# EAGLE design PowerSensingBoard2 (EAGLE 7.5.0)
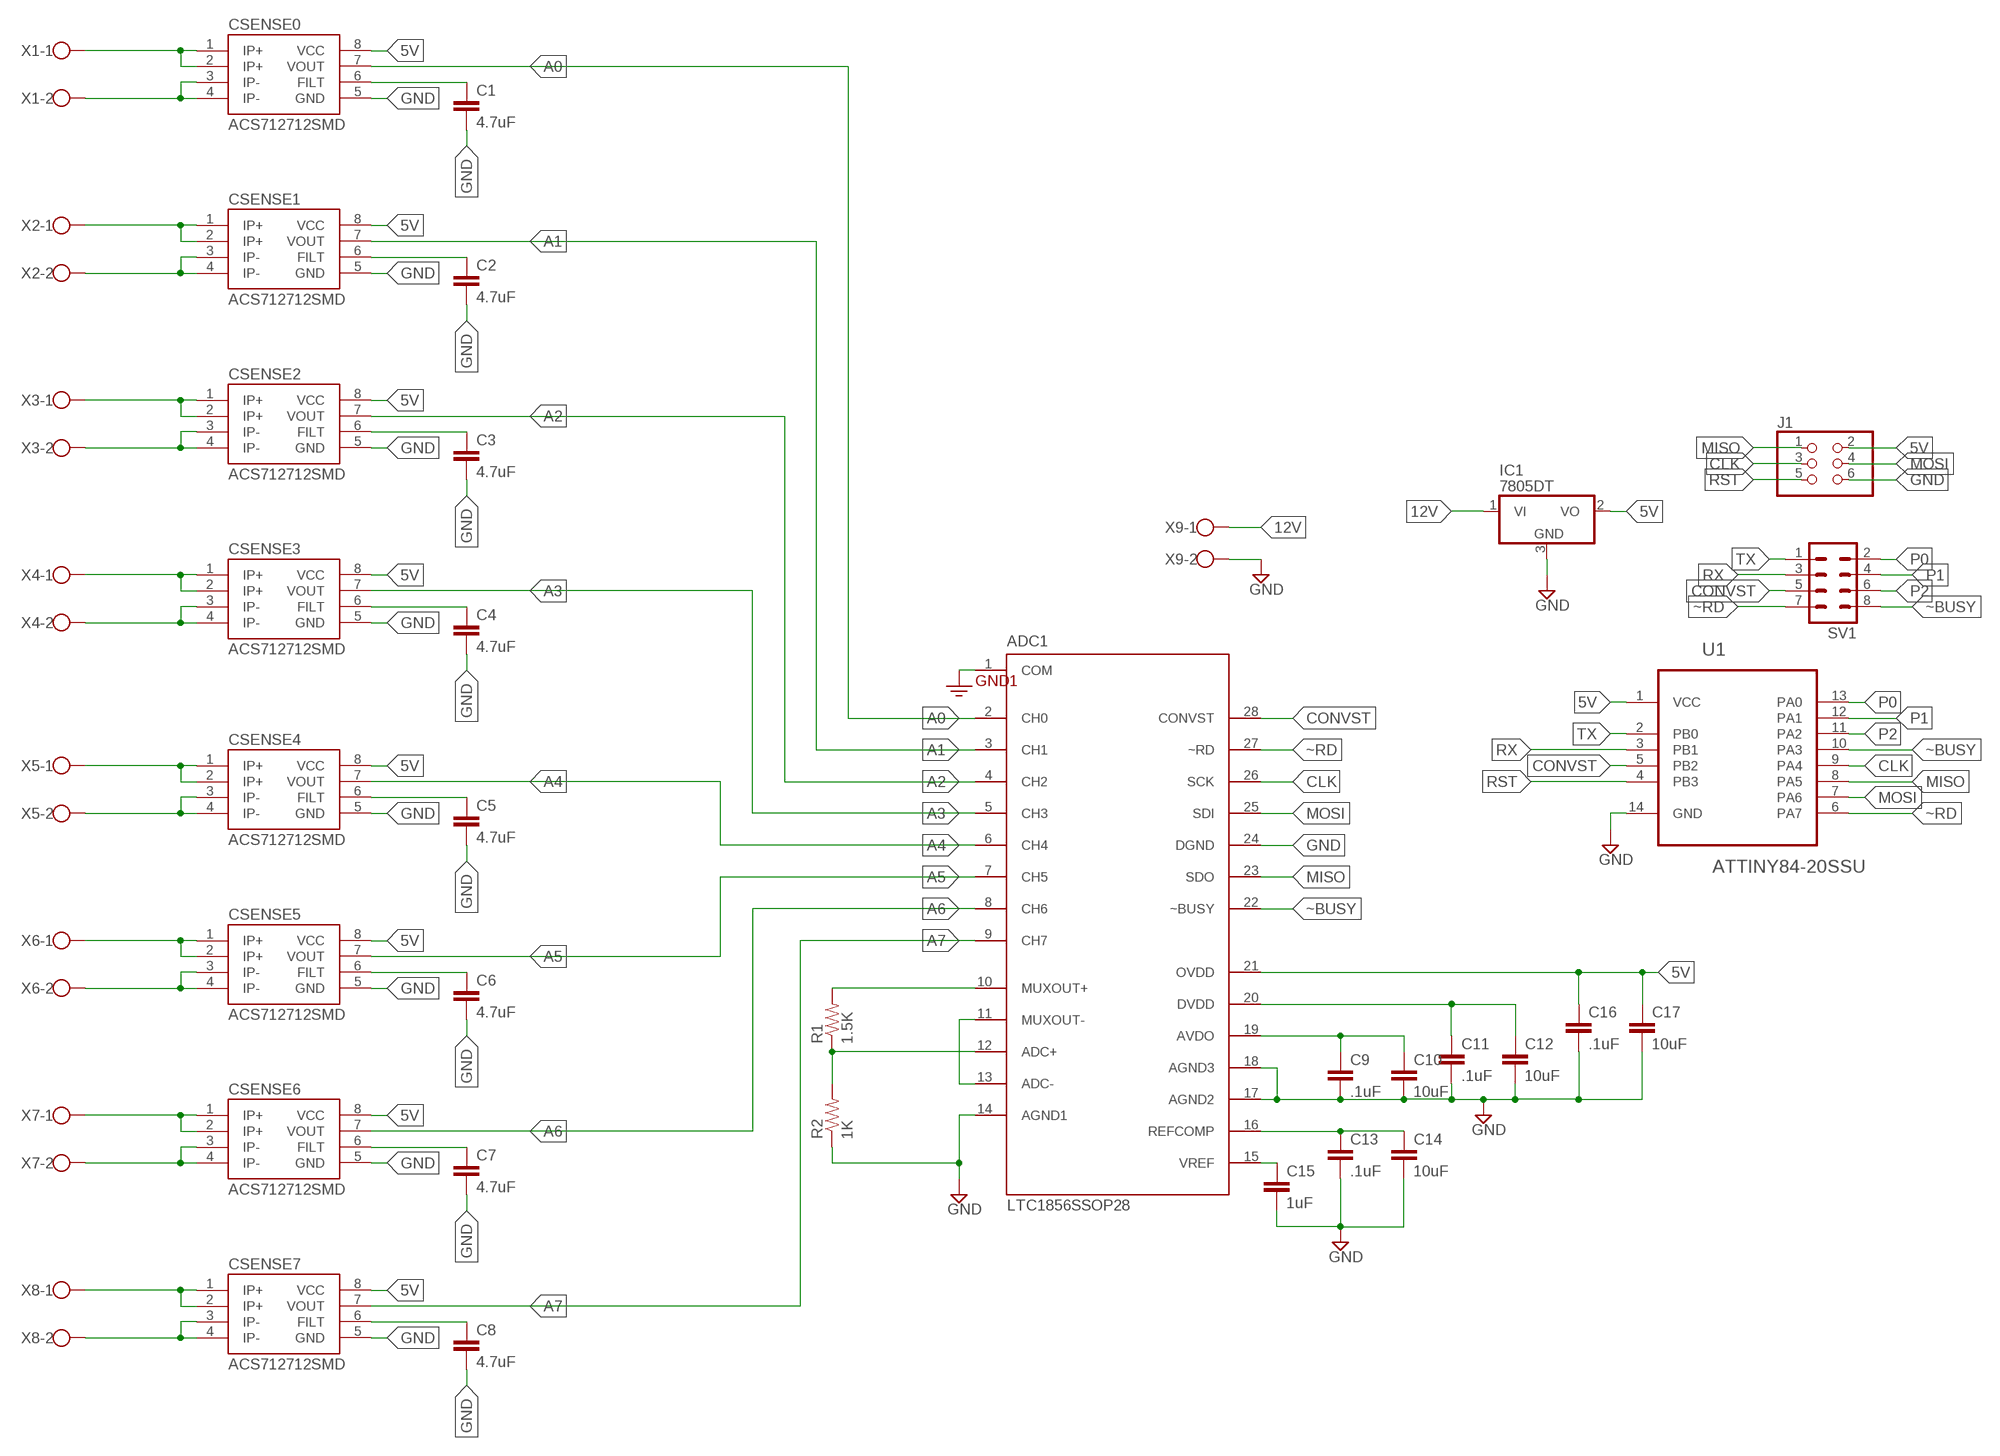
[diagram p0: schematic, sheet 1]

## Parts
ADC1  LTC1856SSOP28  [SSOP-28]
C1  4.7uF  4.7UF-6.3V-10%(0603)0603  [0603-CAP]
C2  4.7uF  4.7UF-6.3V-10%(0603)0603  [0603-CAP]
C3  4.7uF  4.7UF-6.3V-10%(0603)0603  [0603-CAP]
C4  4.7uF  4.7UF-6.3V-10%(0603)0603  [0603-CAP]
C5  4.7uF  4.7UF-6.3V-10%(0603)0603  [0603-CAP]
C6  4.7uF  4.7UF-6.3V-10%(0603)0603  [0603-CAP]
C7  4.7uF  4.7UF-6.3V-10%(0603)0603  [0603-CAP]
C8  4.7uF  4.7UF-6.3V-10%(0603)0603  [0603-CAP]
C9  .1uF  4.7UF-6.3V-10%(0603)0603  [0603-CAP]
C10  10uF  4.7UF-6.3V-10%(0603)0603  [0603-CAP]
C11  .1uF  4.7UF-6.3V-10%(0603)0603  [0603-CAP]
C12  10uF  4.7UF-6.3V-10%(0603)0603  [0603-CAP]
C13  .1uF  4.7UF-6.3V-10%(0603)0603  [0603-CAP]
C14  10uF  4.7UF-6.3V-10%(0603)0603  [0603-CAP]
C15  1uF  4.7UF-6.3V-10%(0603)0603  [0603-CAP]
C16  .1uF  4.7UF-6.3V-10%(0603)0603  [0603-CAP]
C17  10uF  4.7UF-6.3V-10%(0603)0603  [0603-CAP]
CSENSE0  ACS712712SMD  [SO08]
CSENSE1  ACS712712SMD  [SO08]
CSENSE2  ACS712712SMD  [SO08]
CSENSE3  ACS712712SMD  [SO08]
CSENSE4  ACS712712SMD  [SO08]
CSENSE5  ACS712712SMD  [SO08]
CSENSE6  ACS712712SMD  [SO08]
CSENSE7  ACS712712SMD  [SO08]
IC1  7805DT  [TO252]
J1  PINHD-2X3  [2X03]
R1  1.5K  1KOHM-1/10W-1%(0603)  [0603-RES]
R2  1K  1KOHM-1/10W-1%(0603)  [0603-RES]
SV1  MA04-2  [MA04-2]
U1  ATTINY84-20SSU  [SOIC127P600X175-14N]
X1  W237-102  [W237-102]
X2  W237-102  [W237-102]
X3  W237-102  [W237-102]
X4  W237-102  [W237-102]
X5  W237-102  [W237-102]
X6  W237-102  [W237-102]
X7  W237-102  [W237-102]
X8  W237-102  [W237-102]
X9  W237-102  [W237-102]

## Nets
5V: ADC1.21(OVDD) C16.1 C17.1 CSENSE0.8(VCC) CSENSE1.8(VCC) CSENSE2.8(VCC) CSENSE3.8(VCC) CSENSE4.8(VCC) CSENSE5.8(VCC) CSENSE6.8(VCC) CSENSE7.8(VCC) IC1.2(VO) J1.2 U1.1(VCC)
12V: IC1.1(VI) X9.1
A0: ADC1.2(CH0) CSENSE0.7(VOUT)
A1: ADC1.3(CH1) CSENSE1.7(VOUT)
A2: ADC1.4(CH2) CSENSE2.7(VOUT)
A3: ADC1.5(CH3) CSENSE3.7(VOUT)
A4: ADC1.6(CH4) CSENSE4.7(VOUT)
A5: ADC1.7(CH5) CSENSE5.7(VOUT)
A6: ADC1.8(CH6) CSENSE6.7(VOUT)
A7: ADC1.9(CH7) CSENSE7.7(VOUT)
CLK: ADC1.26(SCK) J1.3 U1.9(PA4)
CONVST: ADC1.28(CONVST) SV1.5 U1.5(PB2)
FILT1: C1.1 CSENSE0.6(FILT)
FILT2: C2.1 CSENSE1.6(FILT)
FILT3: C3.1 CSENSE2.6(FILT)
FILT4: C4.1 CSENSE3.6(FILT)
FILT5: C5.1 CSENSE4.6(FILT)
FILT6: C6.1 CSENSE5.6(FILT)
FILT7: C7.1 CSENSE6.6(FILT)
FILT8: C8.1 CSENSE7.6(FILT)
GND: ADC1.1(COM) ADC1.14(AGND1) ADC1.17(AGND2) ADC1.18(AGND3) ADC1.24(DGND) C1.2 C2.2 C3.2 C4.2 C5.2 C6.2 C7.2 C8.2 C9.2 C10.2 C11.2 C12.2 C13.2 C14.2 C15.2 C16.2 C17.2 CSENSE0.5(GND) CSENSE1.5(GND) CSENSE2.5(GND) CSENSE3.5(GND) CSENSE4.5(GND) CSENSE5.5(GND) CSENSE6.5(GND) CSENSE7.5(GND) IC1.3(GND) J1.6 R2.1 X9.2 ; supply symbol labelled GND2
INT1: CSENSE0.1(IP+) CSENSE0.2(IP+) X1.1
INT2: CSENSE1.1(IP+) CSENSE1.2(IP+) X2.1
INT3: CSENSE2.1(IP+) CSENSE2.2(IP+) X3.1
INT4: CSENSE3.1(IP+) CSENSE3.2(IP+) X4.1
INT5: CSENSE4.1(IP+) CSENSE4.2(IP+) X5.1
INT6: CSENSE5.1(IP+) CSENSE5.2(IP+) X6.1
INT7: CSENSE6.1(IP+) CSENSE6.2(IP+) X7.1
INT8: CSENSE7.1(IP+) CSENSE7.2(IP+) X8.1
MISO: ADC1.23(SDO) J1.1 U1.8(PA5)
MOSI: ADC1.25(SDI) J1.4 U1.7(PA6)
N$2: ADC1.10(MUXOUT+) R1.2
N$3: ADC1.12(ADC+) R1.1 R2.2
N$4: U1.14(GND)
N$5: ADC1.11(MUXOUT-) ADC1.13(ADC-)
N$10: ADC1.20(DVDD) C11.1 C12.1
N$11: ADC1.19(AVDO) C9.1 C10.1
N$12: ADC1.15(VREF) C15.1
N$13: ADC1.16(REFCOMP) C13.1 C14.1
OUTT1: CSENSE0.3(IP-) CSENSE0.4(IP-) X1.2
OUTT2: CSENSE1.3(IP-) CSENSE1.4(IP-) X2.2
OUTT3: CSENSE2.3(IP-) CSENSE2.4(IP-) X3.2
OUTT4: CSENSE3.3(IP-) CSENSE3.4(IP-) X4.2
OUTT5: CSENSE4.3(IP-) CSENSE4.4(IP-) X5.2
OUTT6: CSENSE5.3(IP-) CSENSE5.4(IP-) X6.2
OUTT7: CSENSE6.3(IP-) CSENSE6.4(IP-) X7.2
OUTT8: CSENSE7.3(IP-) CSENSE7.4(IP-) X8.2
P0: SV1.2 U1.13(PA0)
P1: SV1.4 U1.12(PA1)
P2: SV1.6 U1.11(PA2)
RST: J1.5 U1.4(PB3)
RX: SV1.3 U1.3(PB1)
TX: SV1.1 U1.2(PB0)
~BUSY: ADC1.22(~BUSY) SV1.8 U1.10(PA3)
~RD: ADC1.27(~RD) SV1.7 U1.6(PA7)

## Library data of the parts
ADC1 = HostlerLib:LTC1856
C1-C8 = SparkFun-Capacitors:4.7UF-6.3V-10%(0603): CAP-08280; PROD_ID: CAP-08280
C9-C17 = SparkFun-Capacitors:4.7UF-6.3V-10%(0603): CAP-08280; PROD_ID: CAP-08280; VALUE: 4.7uF
CSENSE0 CSENSE1-CSENSE7 = SparkFun-AnalogIC:ACS712: Hall-effect-based isolated linear current sensor; PROD_ID: IC-08964
IC1 = adafruit:78*: Positive VOLTAGE REGULATOR Added bigger pads to the TO-92 package
J1 = SparkFun-Connectors:PINHD-2X3: PIN HEADER
R1 = SparkFun-Resistors:1KOHM-1/10W-1%(0603): RES-07856; PROD_ID: RES-07856; VALUE: 1K
R2 = SparkFun-Resistors:1KOHM-1/10W-1%(0603): RES-07856; PROD_ID: RES-07856
SV1 = con-lstb:MA04-2: PIN HEADER; OC_FARNELL: unknown; OC_NEWARK: unknown
U1 = Atmel_By_element14_Batch_1-00:ATTINY84-20SSU: 8-bit Microcontroller with Bytes In-System Programmable Flash; MPN: ATTINY84-20SSU; OC_FARNELL: 1636955; OC_NEWARK: 03P2040; PACKAGE: SOIC-14; SUPPLIER: Atmel
X1-X9 = con-wago-500:W237-102: WAGO SCREW CLAMP; MPN: 237-102; OC_FARNELL: unknown; OC_NEWARK: 70K9898

## Board
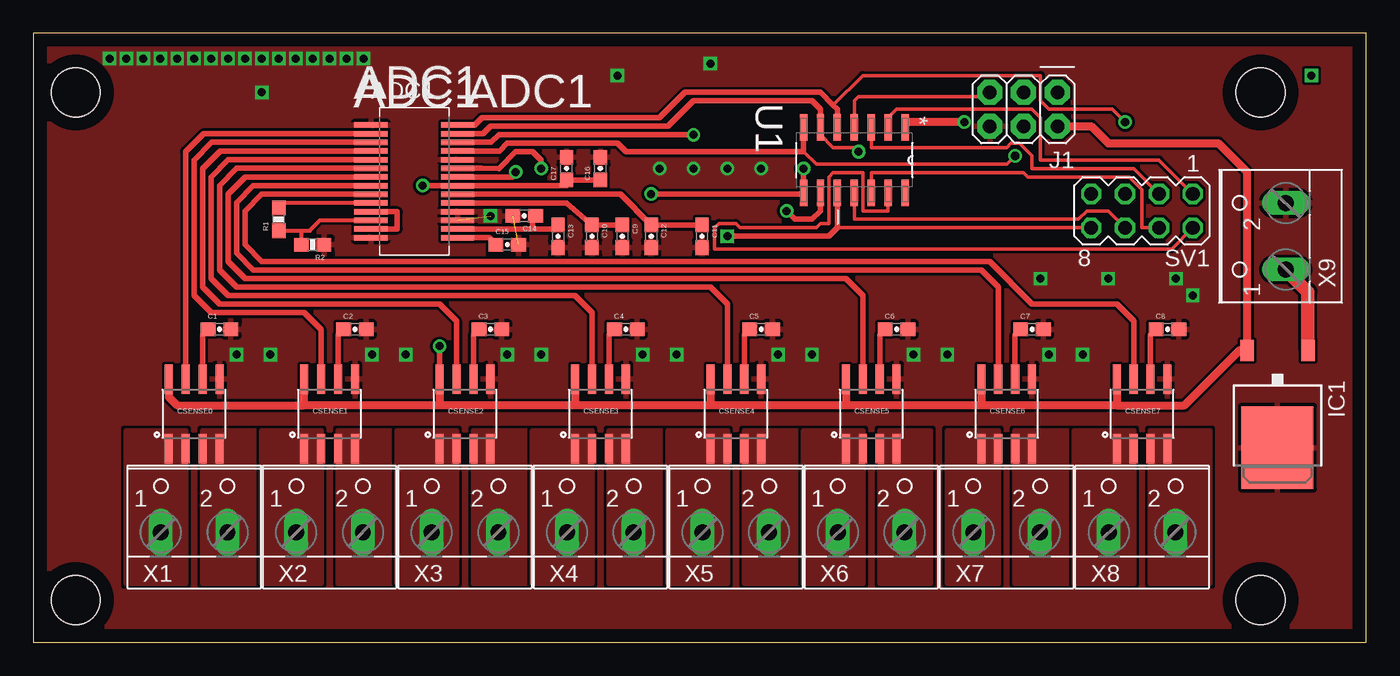
[diagram p1: board, top side]
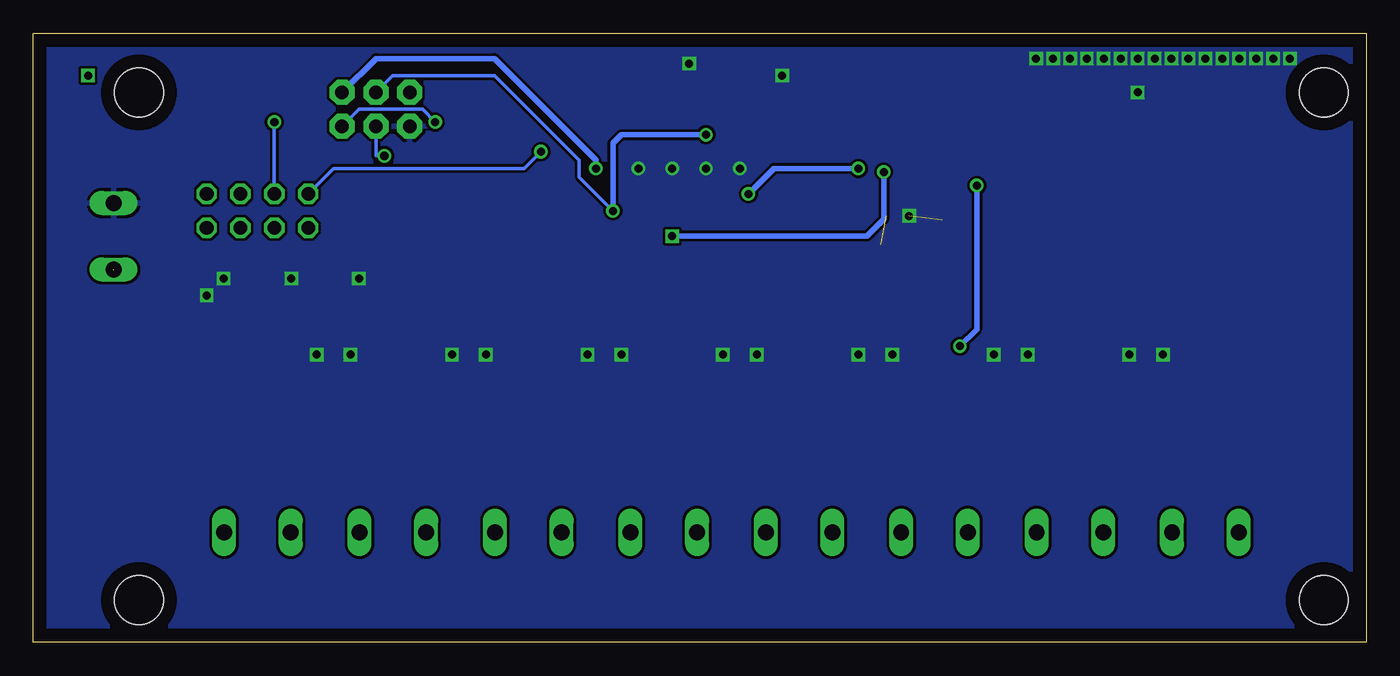
[diagram p2: board, bottom side, seen from below]

Size 100 x 45.71 mm. Coordinates in mm from the lower left corner, seen from the top.
Outline: 0,0 100,0 100,45.71 0,45.71 0,0
Copper layers (1*16): Top 0.035mm / dielectric 1.5mm / Bottom 0.035mm
Design rules "default *": minimum track width 10mil, minimum drill 24mil, track to track 8mil, track to pad 8mil, pad to pad 8mil, via to via 8mil, smd to smd 8mil, copper to edge 40mil, drill to drill 8mil, minimum pad ring 10mil, minimum via ring 8mil, stop-mask expansion 4mil, vias tented up to drill 0mil, thermal gap 10mil
Holes 3.66 mm at 3.17,3.17 3.17,41.27 92.08,41.27 92.08,3.17

### Footprints (pad centres in the part's own frame; a part is rotated, then mirrored left to right if it is on the bottom)
SSOP-28 = smd 2.5 x 0.42: 1 -3.25,3.9; 2 -3.25,3.25; 3 -3.25,2.6; 4 -3.25,1.95; 5 -3.25,1.3; 6 -3.25,0.65; 7 -3.25,0; 8 -3.25,-0.65; 9 -3.25,-1.3; 10 -3.25,-1.95; 11 -3.25,-2.6; 12 -3.25,-3.25; 13 -3.25,-3.9; 14 -3.25,-4.55; 15 3.25,-4.55; 16 3.25,-3.9; 17 3.25,-3.25; 18 3.25,-2.6; 19 3.25,-1.95; 20 3.25,-1.3; 21 3.25,-0.65; 22 3.25,0; 23 3.25,0.65; 24 3.25,1.3; 25 3.25,1.95; 26 3.25,2.6; 27 3.25,3.25; 28 3.25,3.9
0603-CAP = smd 1.1 x 1: 1 -0.85,0; 2 0.85,0
SO08 = smd 0.61 x 2.21: 1 -1.905,-2.616; 2 -0.635,-2.616; 3 0.635,-2.616; 4 1.905,-2.616; 5 1.905,2.616; 6 0.635,2.616; 7 -0.635,2.616; 8 -1.905,2.616
TO252 = smd 1 x 1.6: 1 -2.28,-4.8; 2 2.28,-4.8 | smd 5.4 x 6.2: 3 0,2.5
2X03 = drill 1.016 pad 1.88 octagon: 1 -2.54,-1.27; 2 -2.54,1.27; 3 0,-1.27; 4 0,1.27; 5 2.54,-1.27; 6 2.54,1.27
0603-RES = smd 1.1 x 1: 1 -0.85,0; 2 0.85,0
MA04-2 = drill 1.016 octagon: 1 -3.81,-1.27; 2 -3.81,1.27; 3 -1.27,-1.27; 4 -1.27,1.27; 5 1.27,-1.27; 6 1.27,1.27; 7 3.81,-1.27; 8 3.81,1.27
SOIC127P600X175-14N = smd 1.981 x 0.559: 1 -2.464,3.81; 2 -2.464,2.54; 3 -2.464,1.27; 4 -2.464,0; 5 -2.464,-1.27; 6 -2.464,-2.54; 7 -2.464,-3.81; 8 2.464,-3.81; 9 2.464,-2.54; 10 2.464,-1.27; 11 2.464,0; 12 2.464,1.27; 13 2.464,2.54; 14 2.464,3.81
W237-102 = drill 1.194 long: 1 -2.5,-1.27; 2 2.5,-1.27

### Placement (x,y rotation side)
ADC1  28.57,34.92 0 top
C1  13.97,23.5 0 top
C2  24.13,23.5 0 top
C3  34.29,23.5 0 top
C4  44.45,23.5 0 top
C5  54.61,23.5 0 top
C6  64.77,23.5 0 top
C7  74.93,23.5 0 top
C8  85.09,23.5 0 top
C9  44.2,30.48 270 top
C10  41.91,30.48 270 top
C11  50.16,30.48 270 top
C12  46.35,30.48 270 top
C13  39.37,30.48 270 top
C14  36.83,32 180 top
C15  35.56,29.84 0 top
C16  42.55,35.56 90 top
C17  40.01,35.56 90 top
CSENSE0  12.06,17.14 0 top
CSENSE1  22.23,17.14 0 top
CSENSE2  32.38,17.14 0 top
CSENSE3  42.55,17.14 0 top
CSENSE4  52.7,17.14 0 top
CSENSE5  62.87,17.14 0 top
CSENSE6  73.03,17.14 0 top
CSENSE7  83.19,17.14 0 top
IC1  93.34,17.11 180 top
J1  74.3,40.01 180 top
R1  18.41,31.75 90 top
R2  20.95,29.84 180 top
SV1  83.19,32.38 180 top
U1  61.59,36.2 270 top
X1  12.06,9.53 0 top
X2  22.23,9.53 0 top
X3  32.38,9.53 0 top
X4  42.55,9.53 0 top
X5  52.7,9.53 0 top
X6  62.87,9.53 0 top
X7  73.03,9.53 0 top
X8  83.19,9.53 0 top
X9  92.71,30.48 90 top

### Tracks (layer width: path | path; a pad name or v marks a point on that pad's centre or on a via)
5V  (via drill 0.6, 0.61)
  Top 0.254: 65.41,38.73 U1.1
  Top 0.406: C16.1 C17.1 40.01,34.27 ADC1.21 29.23,34.27 v29.21,34.29 | v30.48,22.23 CSENSE2.8
  Top 0.508: 65.72,39.05 65.41,38.73
  Top 0.61: 20.32,17.78 CSENSE1.8 | CSENSE2.8 30.48,17.78 | 30.48,17.78 20.32,17.78 | CSENSE3.8 40.64,17.78 | 40.64,17.78 30.48,17.78 | CSENSE4.8 50.8,17.78 | 50.8,17.78 40.64,17.78 | CSENSE5.8 60.96,17.78 | 60.96,17.78 50.8,17.78 | CSENSE6.8 71.12,17.78 | 71.12,17.78 60.96,17.78 | CSENSE7.8 81.28,17.78 | 81.28,17.78 71.12,17.78 | CSENSE0.8 10.16,18.41 10.79,17.78 20.32,17.78 | v69.85,39.05 65.72,39.05 | 81.28,17.78 86.36,17.78 88.9,20.32 90.48,21.91 IC1.2 91.06,35.3 88.9,37.47 80.64,37.47 79.38,38.73 J1.2
  Bottom 0.254: v69.85,39.05 70.8,40.01 75.56,40.01 J1.2
  Bottom 0.406: v29.21,34.29 29.21,23.5 v30.48,22.23
12V  (1 unrouted)
  Top 1.016: IC1.1 95.62,26.3 93.98,27.94
A0
  Top 0.406: ADC1.2 12.78,38.17 11.43,36.83 CSENSE0.7
A1
  Top 0.406: ADC1.3 13.39,37.52 12.06,36.2 12.06,26.04 13.34,24.77 20.32,24.77 21.59,23.5 CSENSE1.7
A2
  Top 0.406: ADC1.4 14.02,36.88 12.7,35.56 12.7,26.67 13.97,25.4 30.48,25.4 31.75,24.13 CSENSE2.7
A3
  Top 0.406: ADC1.5 14.63,36.23 13.34,34.92 13.34,27.3 14.61,26.04 40.64,26.04 41.91,24.77 CSENSE3.7
A4
  Top 0.406: ADC1.6 15.26,35.58 13.97,34.29 13.97,27.94 15.24,26.67 50.8,26.67 52.07,25.4 CSENSE4.7
A5
  Top 0.406: ADC1.7 15.88,34.92 14.61,33.66 14.61,28.57 15.88,27.3 60.96,27.3 62.23,26.04 CSENSE5.7
A6
  Top 0.406: ADC1.8 16.5,34.27 15.24,33.02 15.24,29.21 16.51,27.94 71.12,27.94 72.39,26.67 CSENSE6.7
A7
  Top 0.406: ADC1.9 25.3,33.66 17.14,33.66 15.88,32.38 15.88,29.84 17.14,28.57 71.75,28.57 74.93,25.4 81.28,25.4 82.55,24.13 CSENSE7.7
CLK  (via drill 0.6)
  Top 0.406: ADC1.26 34.35,37.52 34.92,38.1 v49.53,38.1 | U1.9 59.05,32.38 58.42,31.75 57.15,31.75 v56.52,32.38
  Bottom 0.254: J1.3 73.03,42.55 65.41,42.55 59.05,36.2 59.05,34.92 v56.52,32.38
  Bottom 0.406: v56.52,32.38 56.52,37.47 55.88,38.1 v49.53,38.1
CONVST  (via drill 0.61)
  Top 0.254: v81.92,39.05 80.96,40.01 76.2,40.01 75.56,40.64 75.56,42.55 62.23,42.55 60.01,40.32
  Top 0.406: ADC1.28 33.11,38.83 33.66,39.37 46.99,39.37 48.9,41.27 59.05,41.27 60.01,40.32 60.33,40.01 U1.5
  Bottom 0.254: v81.92,39.05 SV1.5
FILT1
  Top 0.406: CSENSE0.6 12.7,23.07 C1.1
FILT2
  Top 0.406: CSENSE1.6 22.86,23.07 C2.1
FILT3
  Top 0.406: CSENSE2.6 33.02,23.07 C3.1
FILT4
  Top 0.406: CSENSE3.6 43.18,23.07 C4.1
FILT5
  Top 0.406: CSENSE4.6 53.34,23.07 C5.1
FILT6
  Top 0.406: CSENSE5.6 63.5,23.07 C6.1
FILT7
  Top 0.406: CSENSE6.6 73.66,23.07 C7.1
FILT8
  Top 0.406: CSENSE7.6 83.82,23.07 C8.1
GND  (via drill 0.6)  (2 unrouted)
  other vias: 15.24,21.59 25.4,21.59 35.56,21.59 45.72,21.59 55.88,21.59 66.04,21.59 76.2,21.59 43.81,42.55 17.14,41.27 87,26.04 50.8,43.43 34.29,32 46.99,35.56 49.53,35.56 52.07,35.56 54.61,35.56 9.53,43.81 10.79,43.81 12.06,43.81 13.34,43.81 14.61,43.81 15.88,43.81 17.14,43.81 18.41,43.81 18.41,43.81 19.68,43.81 20.95,43.81 22.23,43.81 23.5,43.81 24.77,43.81 8.26,43.81 6.99,43.81 5.71,43.81 17.78,21.59 27.94,21.59 38.1,21.59 48.26,21.59 58.42,21.59 68.58,21.59 78.74,21.59 75.56,27.3 80.64,27.3 85.72,27.3
  pour Top (rank 5): 0,45.72 100.33,45.72 100.33,0 0,0
  pour Bottom (rank 5): 0,45.72 100.33,45.72 100.33,0 0,0
INT1
  pour Top (no thermals): 6.99,15.88 11.43,15.88 11.43,4.45 6.99,4.45
INT2
  pour Top (no thermals): 17.14,15.88 21.59,15.88 21.59,4.45 17.14,4.45
INT3
  pour Top (no thermals): 27.3,15.88 31.75,15.88 31.75,4.45 27.3,4.45
INT4
  pour Top (no thermals): 37.47,15.88 41.91,15.88 41.91,4.45 37.47,4.45
INT5
  pour Top (no thermals): 47.62,15.88 52.07,15.88 52.07,4.45 47.62,4.45
INT6
  pour Top (no thermals): 57.78,15.88 62.23,15.88 62.23,4.45 57.78,4.45
INT7
  pour Top (no thermals): 68.58,15.88 72.39,15.88 72.39,4.45 68.58,4.45
INT8
  pour Top (no thermals): 78.11,15.88 82.55,15.88 82.55,4.45 78.11,4.45
MISO  (via drill 0.6)
  Top 0.406: ADC1.23 33.64,35.58 34.92,35.56 36.2,36.83 37.47,36.83 38.1,36.2 v38.1,35.56 | v46.35,33.66 57.71,33.66 U1.8 v57.78,35.56
  Bottom 0.406: v46.35,33.66 44.45,35.56 v38.1,35.56 | J1.1 74.3,43.81 65.41,43.81 57.78,36.2 v57.78,35.56
MOSI  (via drill 0.61)
  Top 0.254: v73.66,36.51 73.03,35.88 58.74,35.88 57.78,36.83
  Top 0.406: U1.7 57.78,36.83 44.45,36.83 43.81,37.47 35.56,37.47 34.97,36.88 ADC1.25
  Bottom 0.254: J1.4 74.3,36.51 v73.66,36.51
N$2
  Top 0.305: ADC1.10 18.41,32.98 R1.2
N$3
  Top 0.305: R1.1 20.11,30.9 | 20.11,30.9 R2.2 | 20.11,30.9 20.74,30.9 21.52,31.68 ADC1.12
N$5
  Top 0.406: ADC1.13 27.3,31.02 27.3,32.33 ADC1.11
N$6  (via drill 0.6)
  other vias: 95.89,42.55
N$10
  Top 0.406: C11.1 C12.1 44.06,33.62 ADC1.20
N$11
  Top 0.406: ADC1.19 40.01,32.98 C10.1 C9.1
N$12
  Top 0.406: ADC1.15 34.18,30.38 C15.1
N$13
  Top 0.406: ADC1.16 37.47,31.02 | 37.47,31.02 39.37,31.02 C13.1 | C14.1 37.47,32 37.47,31.02
OUTT1
  pour Top (rank 2, no thermals): 12.7,15.88 17.14,15.88 17.14,4.45 12.7,4.45
OUTT2
  pour Top (rank 2, no thermals): 22.86,15.88 27.3,15.88 27.3,4.45 22.86,4.45
OUTT3
  pour Top (rank 2, no thermals): 33.02,15.88 37.47,15.88 37.47,4.45 33.02,4.45
OUTT4
  pour Top (rank 2, no thermals): 43.18,15.88 47.62,15.88 47.62,4.45 43.18,4.45
OUTT5
  pour Top (rank 2, no thermals): 53.34,15.88 57.78,15.88 57.78,4.45 53.34,4.45
OUTT6
  pour Top (rank 2, no thermals): 63.5,15.88 67.31,15.88 67.31,4.45 63.5,4.45
OUTT7
  pour Top (rank 2, no thermals): 73.66,15.88 78.11,15.88 78.11,4.45 73.66,4.45
OUTT8
  pour Top (rank 2, no thermals): 83.82,15.88 88.27,15.88 88.27,4.45 83.82,4.45
P0
  Top 0.254: U1.13 64.14,32.38 62.23,32.38 62.23,35.24 60.01,35.24 59.69,34.92 59.69,31.43 59.05,31.43 58.74,31.11 53.02,31.11 52.7,31.43 51.44,31.43 51.12,31.11 51.12,29.53 85.41,29.53 SV1.2
P1
  Top 0.254: U1.12 62.87,35.24 74.3,35.24 74.61,34.92 82.23,34.92 83.19,33.97 83.19,31.11 SV1.4
P2
  Top 0.254: U1.11 61.59,31.75 78.42,31.75 79.06,32.38 80.64,32.38 SV1.6
RST
  Top 0.254: U1.4 61.59,40.64 61.91,40.96 62.87,40.96 71.44,40.96 J1.5
RX
  Top 0.254: U1.3 62.87,37.15 73.03,37.15 73.34,37.47 73.98,37.47 74.93,36.51 74.93,35.56 82.55,35.56 SV1.3
TX
  Top 0.254: U1.2 64.14,39.37 64.77,40.01 74.93,40.01 75.56,39.37 75.56,36.2 84.45,36.2 SV1.1
~BUSY  (via drill 0.6)
  Top 0.254: 60.33,31.11 SV1.8
  Top 0.406: v52.07,30.48 59.69,30.48 60.33,31.11 U1.10 | ADC1.22 35.94,34.92 v36.2,35.31
  Bottom 0.406: v36.2,35.31 36.2,31.75 37.47,30.48 v52.07,30.48
~RD  (via drill 0.61)
  Top 0.254: v61.91,36.83 61.59,37.15 60.01,37.15 59.05,38.1 U1.6
  Top 0.406: ADC1.27 33.73,38.17 34.29,38.73 47.62,38.73 49.53,40.64 58.42,40.64 59.05,40.01 U1.6
  Bottom 0.254: SV1.7 77.47,35.56 63.18,35.56 v61.91,36.83